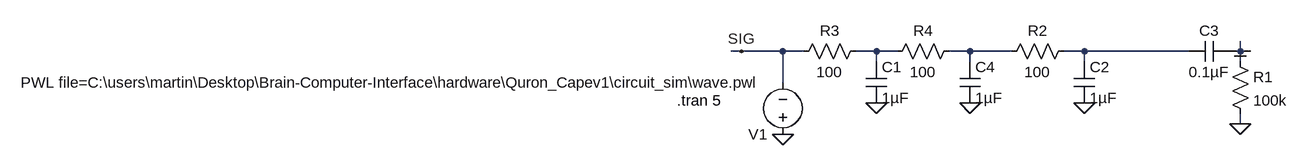
[diagram p0: schematic Draft2.asc]
Draft2.asc, the LTspice schematic file:
Version 4
SHEET 1 880 1440
WIRE -16 144 -32 144
WIRE 48 144 -16 144
WIRE 80 144 48 144
WIRE 192 144 160 144
WIRE 224 144 192 144
WIRE 336 144 304 144
WIRE 400 144 336 144
WIRE 512 144 480 144
WIRE 672 144 512 144
WIRE 752 144 752 128
WIRE 752 144 736 144
WIRE 192 160 192 144
WIRE 336 160 336 144
WIRE 512 160 512 144
WIRE 752 160 752 144
WIRE 48 192 48 144
WIRE 752 256 752 240
FLAG 192 224 0
FLAG 48 272 0
FLAG 752 256 0
FLAG -16 144 SIG
FLAG 336 224 0
FLAG 752 144 COM
FLAG 512 224 0
SYMBOL cap 176 160 R0
SYMATTR InstName C1
SYMATTR Value 1µF
SYMATTR SpiceLine V=50
SYMBOL res 176 128 R90
WINDOW 0 0 56 VBottom 2
WINDOW 3 32 56 VTop 2
SYMATTR InstName R3
SYMATTR Value 100
SYMATTR SpiceLine tol=5
SYMBOL voltage 48 288 R180
WINDOW 123 0 0 Left 0
WINDOW 39 0 0 Left 0
SYMATTR InstName V1
SYMATTR Value PWL file=C:\users\martin\Desktop\Brain-Computer-Interface\hardware\Quron_Capev1\circuit_sim\wave.pwl
SYMBOL res 736 144 R0
SYMATTR InstName R1
SYMATTR Value 100k
SYMATTR SpiceLine tol=5
SYMBOL cap 736 128 R90
WINDOW 0 0 32 VBottom 2
WINDOW 3 32 32 VTop 2
SYMATTR InstName C3
SYMATTR Value 0.1µF
SYMATTR SpiceLine V=50
SYMBOL cap 320 160 R0
SYMATTR InstName C4
SYMATTR Value 1µF
SYMATTR SpiceLine V=50
SYMBOL res 320 128 R90
WINDOW 0 0 56 VBottom 2
WINDOW 3 32 56 VTop 2
SYMATTR InstName R4
SYMATTR Value 100
SYMATTR SpiceLine tol=5
SYMBOL cap 496 160 R0
SYMATTR InstName C2
SYMATTR Value 1µF
SYMATTR SpiceLine V=50
SYMBOL res 496 128 R90
WINDOW 0 0 56 VBottom 2
WINDOW 3 32 56 VTop 2
SYMATTR InstName R2
SYMATTR Value 100
SYMATTR SpiceLine tol=5
TEXT -46 220 Right 2 !.tran 5

The netlist it stands for:
* Draft2.asc
C1 N001 0 1µF V=50
R3 N001 SIG 100 tol=5
V1 0 SIG PWL file=C:\users\martin\Desktop\Brain-Computer-Interface\hardware\Quron_Capev1\circuit_sim\wave.pwl
R1 COM 0 100k tol=5
C3 COM N003 0.1µF V=50
C4 N002 0 1µF V=50
R4 N002 N001 100 tol=5
C2 N003 0 1µF V=50
R2 N003 N002 100 tol=5
.tran 5
.backanno
.end

* Results of the author's LTspice run, read from the files saved beside the schematic
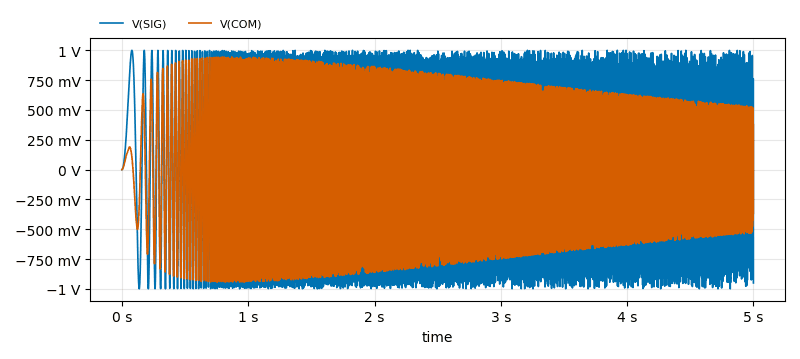
[diagram p1: Transient Analysis of Draft2.asc, plotted from the saved traces]
* Transient Analysis, 1 run:
*   V(SIG): min -1 V, max 1 V, average 7.844 mV, rms 677.5 mV, last 0 V
*   V(COM): min -945.3 mV, max 945.6 mV, average -20.39 µV, rms 546.3 mV, last -469.7 mV